# EAGLE design Electronic Synchronized Fireflies (EAGLE 6.4)
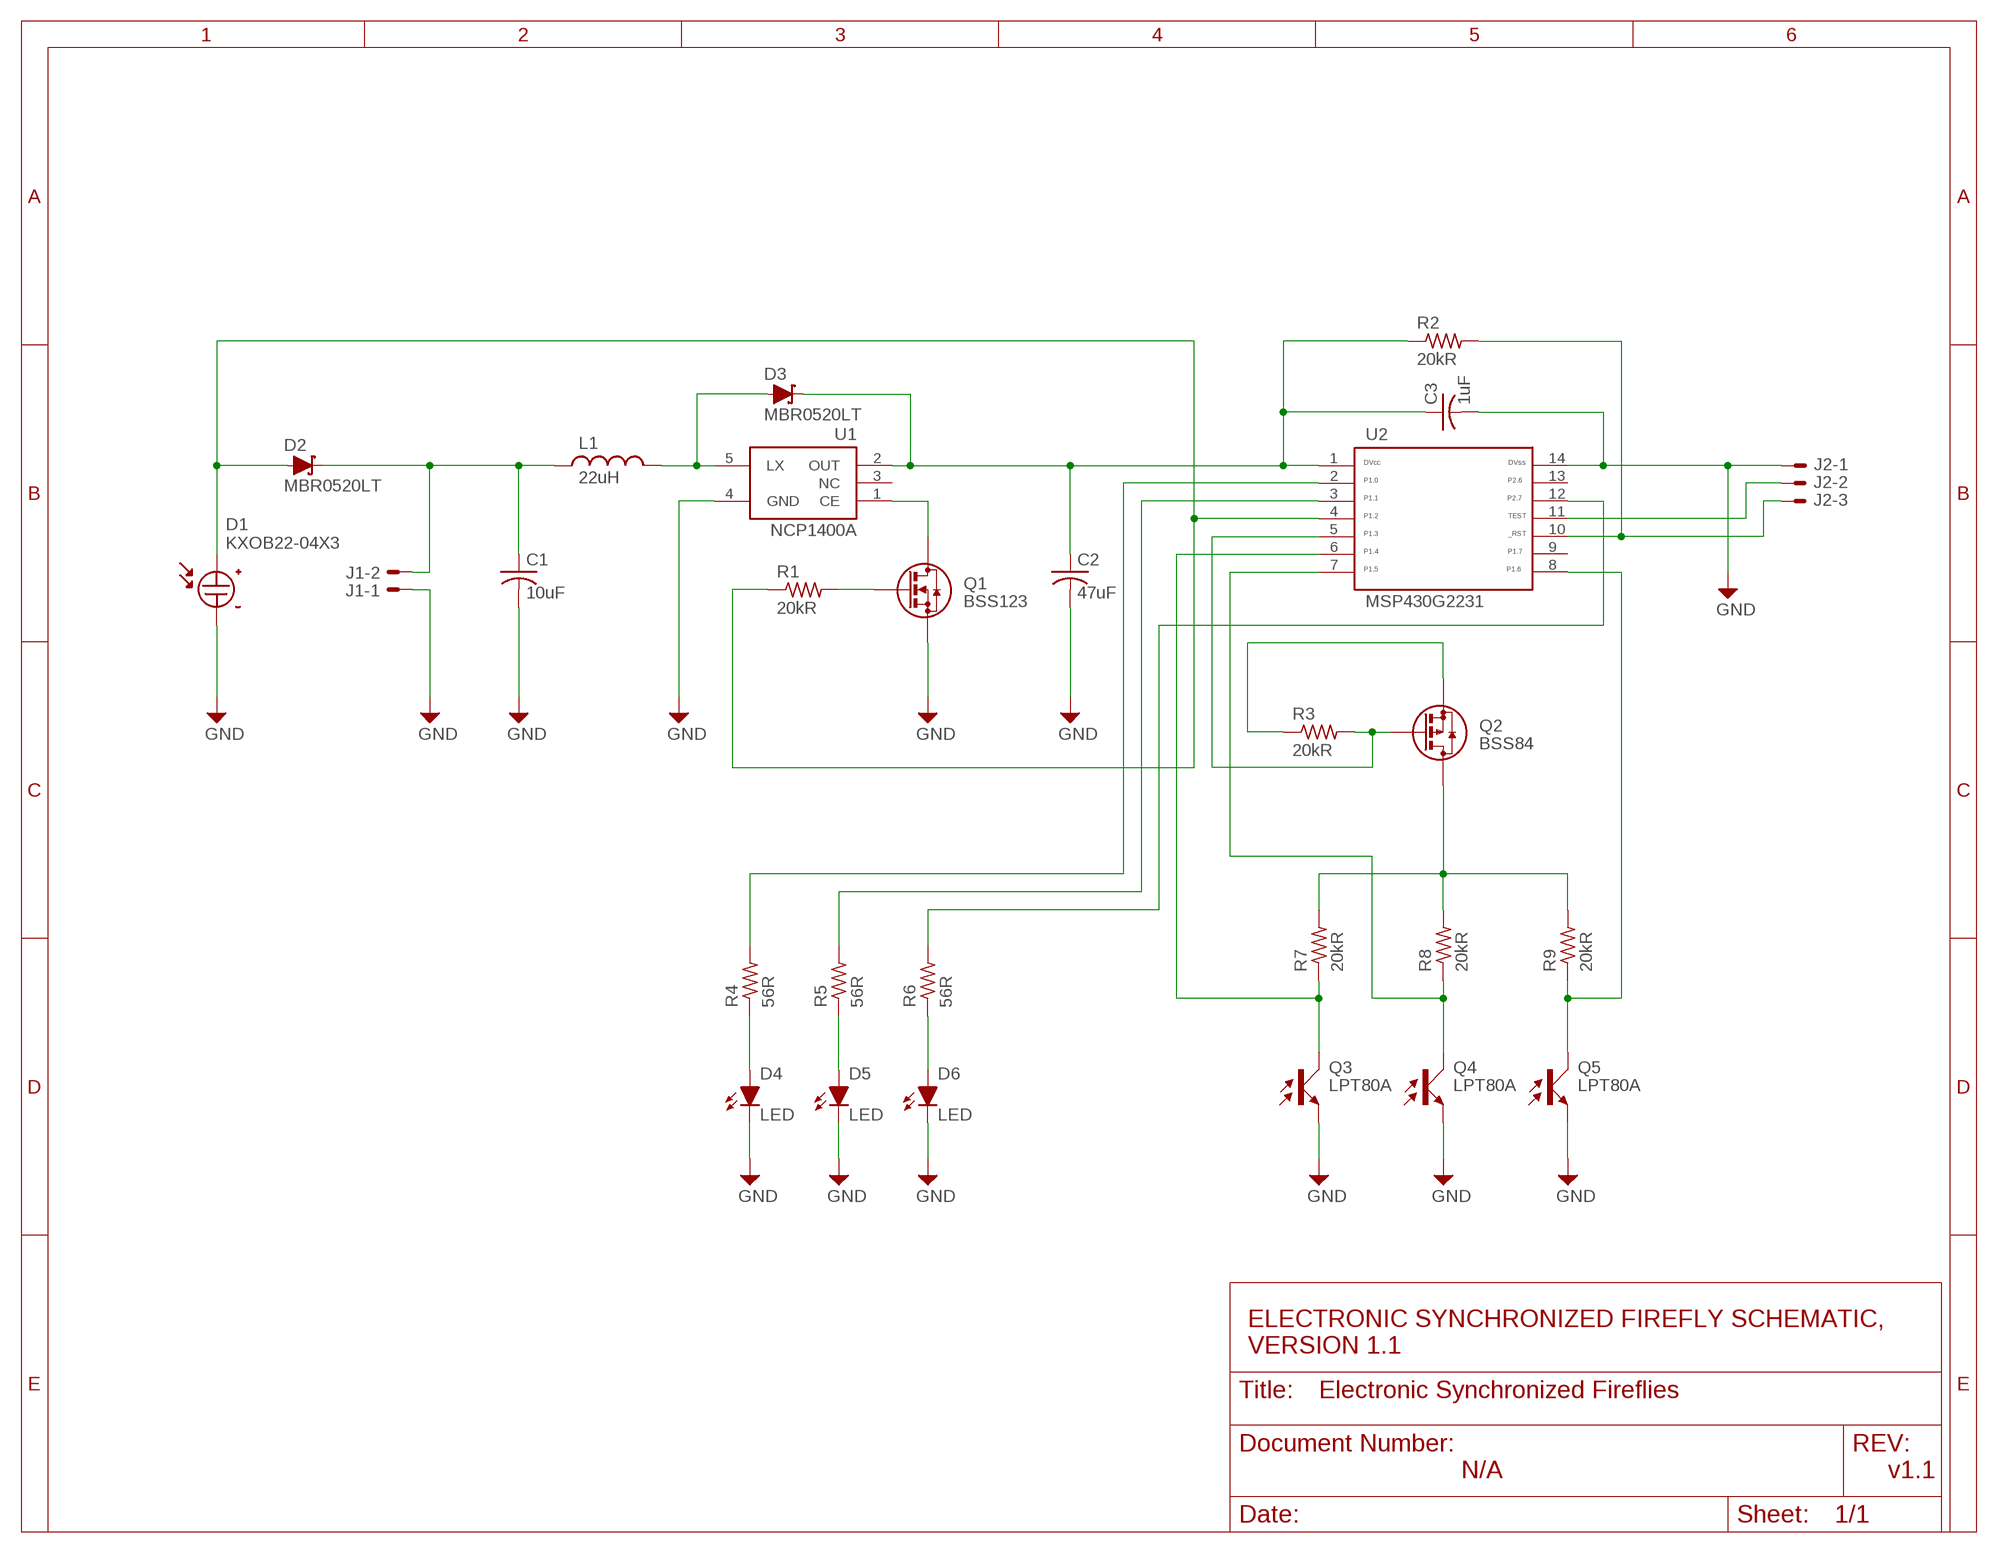
[diagram p0: schematic, sheet 1]

## Parts
C1  10uF  CAPACITOR  [CAPACITOR_0805]
C2  47uF  CAPACITOR  [CAPACITOR_0805]
C3  1uF  CAPACITOR  [CAPACITOR_0805]
D1  KXOB22-04X3  [KXOB22-04X3]
D2  MBR0520LT  [SOD123]
D3  MBR0520LT  [SOD123]
D4  LED  LEDRTANGLEHOLDER  [LED5MMRT]
D5  LED  LEDRTANGLEHOLDER  [LED5MMRT]
D6  LED  LEDRTANGLEHOLDER  [LED5MMRT]
FRAME1  FRAME_A_L  [FRAME_A_L]
J1  2WIRE_HEADER  [2WIRE_HEADER]
J2  3WIRE_HEADER  [3WIRE_HEADER]
L1  22uH  INDUCTOR  [INDUCTOR_1007]
Q1  BSS123  [SOT23]
Q2  BSS84  [SOT23]
Q3  LPT80A  LPT80ARTANGLEHOLDER  [LED5MMRT]
Q4  LPT80A  LPT80ARTANGLEHOLDER  [LED5MMRT]
Q5  LPT80A  LPT80ARTANGLEHOLDER  [LED5MMRT]
R1  20kR  RESISTOR  [RESISTOR_0805]
R2  20kR  RESISTOR  [RESISTOR_0805]
R3  20kR  RESISTOR  [RESISTOR_0805]
R4  56R  RESISTOR  [RESISTOR_0805]
R5  56R  RESISTOR  [RESISTOR_0805]
R6  56R  RESISTOR  [RESISTOR_0805]
R7  20kR  RESISTOR  [RESISTOR_0805]
R8  20kR  RESISTOR  [RESISTOR_0805]
R9  20kR  RESISTOR  [RESISTOR_0805]
U1  NCP1400A  [SOT23-5]
U2  MSP430G2231  [TSSOP-14]
U$1  DOCFIELD  [DOCFIELD]

## Nets
GND: C1.2 C2.2 C3.2 D1.P$2(-) D4.K(C) D5.K(C) D6.K(C) J1.1 J2.1 Q1.3(D) Q3.K(E) Q4.K(E) Q5.K(E) U1.4(GND) U2.14
N$1: C1.1 D2.C J1.2 L1.P$1
N$2: D1.P$1(+) D2.A R1.1 U2.4
N$3: D3.A L1.P$2 U1.5(LX)
N$4: Q2.1(G) R3.2 U2.5
N$5: C2.1 C3.1 D3.C R2.1 U1.2(OUT) U2.1
N$6: Q1.2(S) U1.1(CE)
N$7: Q1.1(G) R1.2
N$9: J2.3 R2.2 U2.10
N$10: Q2.2(S) R3.1
N$11: J2.2 U2.11
N$12: Q2.3(D) R7.2 R8.2 R9.2
N$13: Q4.A(C) R8.1 U2.7
N$14: Q3.A(C) R7.1 U2.6
N$15: Q5.A(C) R9.1 U2.8
N$16: R4.2 U2.2
N$17: R5.2 U2.3
N$18: R6.2 U2.12
N$20: D5.A R5.1
N$21: D6.A R6.1
N$22: D4.A R4.1
Unconnected: U1.3(NC) U2.9 U2.13

## Notes on the sheet
- ELECTRONIC SYNCHRONIZED FIREFLY SCHEMATIC, 
  VERSION 1.1
- N/A | v1.1

## Library data of the parts
C1-C3 = Electronic Synchronized Fireflies:CAPACITOR
D1 = Electronic Synchronized Fireflies:KXOB22-04X3: IXOLAR High Efficiency SolarBIT
D2 D3 = Electronic Synchronized Fireflies:MBR0520LT: SCHOTTKY BARRIER RECTIFIER Source: http://onsemi.com .. MBR0520LT1-D.pdf
D4-D6 = Electronic Synchronized Fireflies:LED
FRAME1 = Electronic Synchronized Fireflies:FRAME_A_L: FRAME A Size , 8 1/2 x 11 INCH, Landscape
J1 = Electronic Synchronized Fireflies:2WIRE_HEADER: .100" (2.54mm) Center Header - 2 Pin; MF: MOLEX; MPN: 22-23-2021; OC_FARNELL: 1462926; OC_NEWARK: 25C3832
J2 = Electronic Synchronized Fireflies:3WIRE_HEADER: .100" (2.54mm) Center Header - 3 Pin; MF: MOLEX; MPN: 22-23-2031; OC_FARNELL: 1462950; OC_NEWARK: 30C0862
L1 = Electronic Synchronized Fireflies:INDUCTOR
Q1 = Electronic Synchronized Fireflies:BSS123: N-CHANNEL MOS FET
Q2 = Electronic Synchronized Fireflies:BSS84: P-CHANNEL MOS FET
Q3-Q5 = Electronic Synchronized Fireflies:LPT80A: PHOTO TRANSISTOR
R1-R9 = Electronic Synchronized Fireflies:RESISTOR
U1 = Electronic Synchronized Fireflies:NCP1400A: NCP1400A - 100mA PWM Step-Up Regulator 100mA step-up DC-to-DC converter with low 0.8V startup. 3.3V Version (SOT23-5) - Digikey: NCP1400ASN33T1GOSCT-ND 5.0V Version (SOT23-5) - Digikey: NCP1400ASN50T1GOSCT-ND NCP1402 - 200mA PWM Step-Up Regulator 200mA step-up DC-to-DC converter with low 0.8V startup 3.3V Version (SOT23-5) - Digikey: NCP1402SN33T1GOSCT-ND 5.0V Version (SOT23-5) - Digikey: NCP1402SN50T1GOSCT-ND
U2 = Electronic Synchronized Fireflies:MSP430G2231: MSP430G2231 TSSOP (PW) 14 Pin Package http://focus.ti.com/docs/prod/folders/print/msp430g2231.html
U$1 = Electronic Synchronized Fireflies:DOCFIELD

## Board
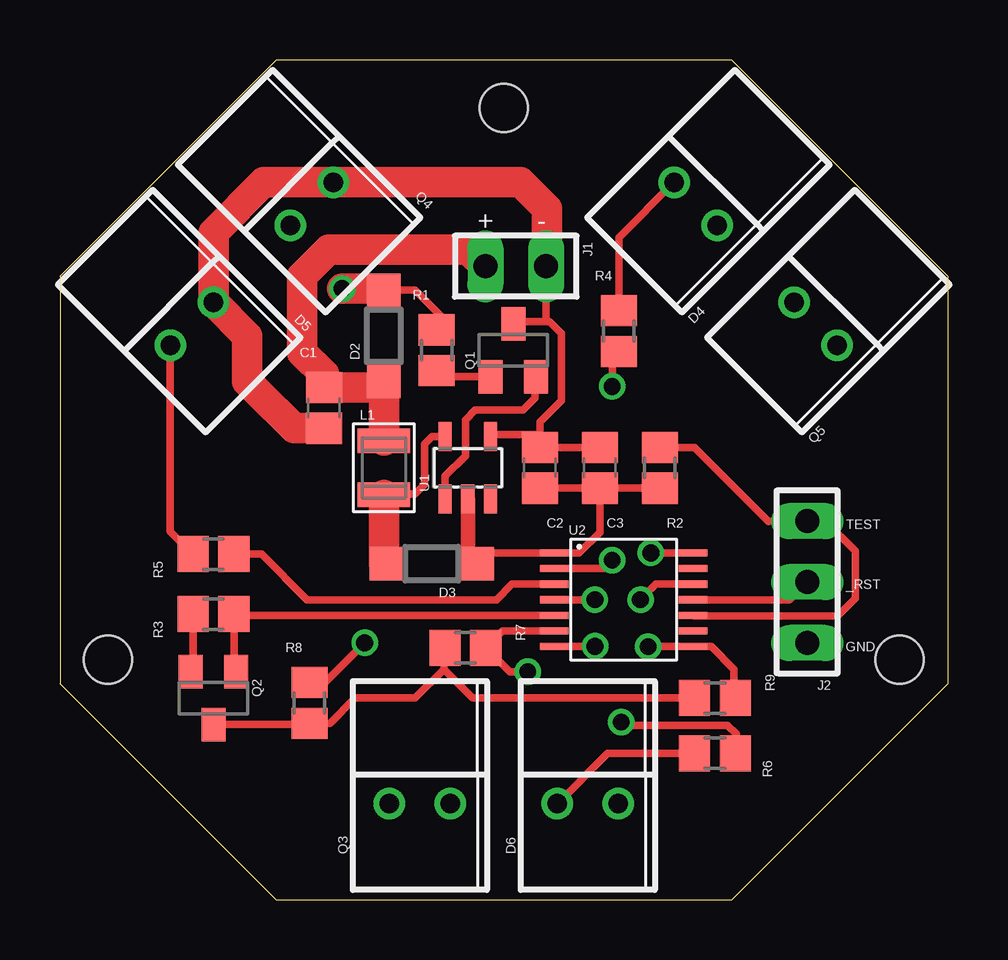
[diagram p1: board, top side]
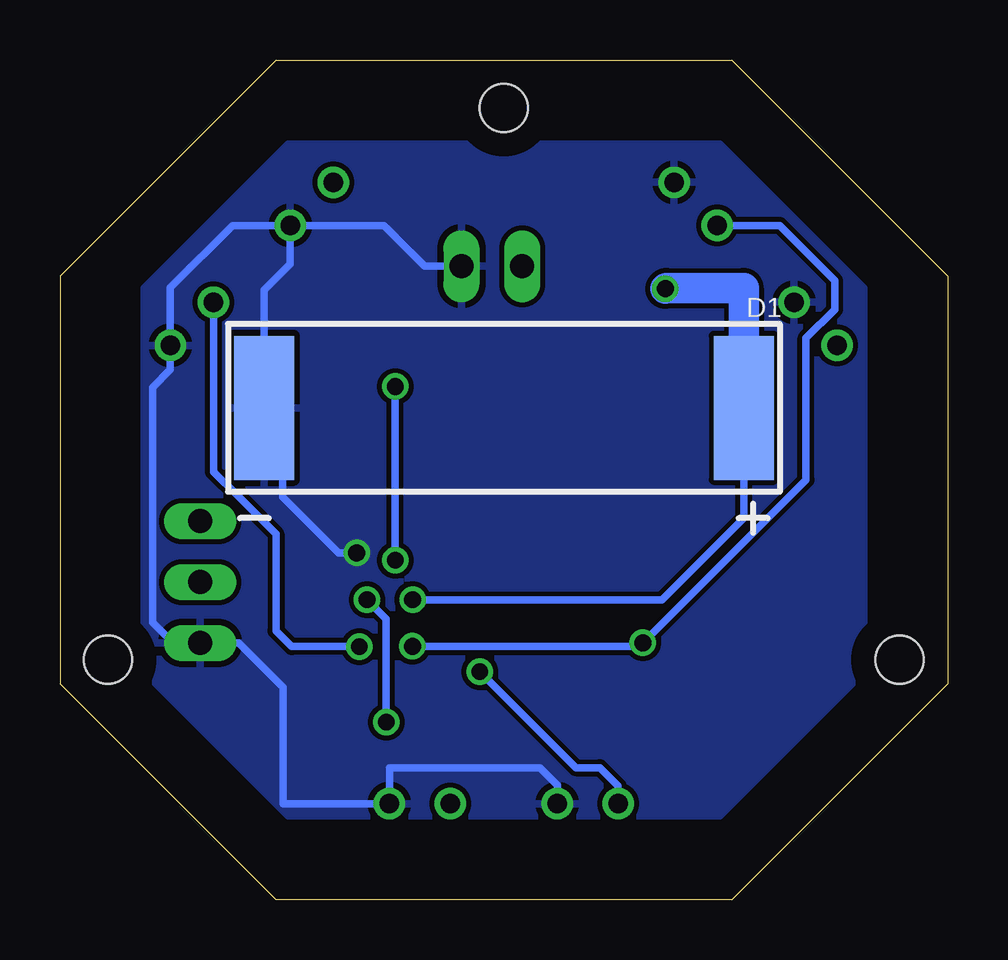
[diagram p2: board, bottom side, seen from below]

Size 37 x 35 mm. Coordinates in mm from the lower left corner, seen from the top.
Outline: 28,35 9,35 0,26 0,9 9,0 28,0 37,9 37,26 28,35
Copper layers (1*16): Top 0.035mm / dielectric 1.5mm / Bottom 0.035mm
Design rules "default": minimum track width 10mil, minimum drill 24mil, track to track 8mil, track to pad 8mil, pad to pad 8mil, via to via 8mil, smd to smd 8mil, copper to edge 40mil, drill to drill 8mil, minimum pad ring 10mil, minimum via ring 8mil, stop-mask expansion 4mil, vias tented up to drill 0mil, thermal gap 10mil
Holes 2 mm at 2,10 35,10 18.5,33

### Footprints (pad centres in the part's own frame; a part is rotated, then mirrored left to right if it is on the bottom)
CAPACITOR_0805 = smd 1.3 x 1.5: 1 -0.85,0; 2 0.85,0
KXOB22-04X3 = smd 2.5 x 6: P$1 -10,0; P$2 10,0
SOD123 = smd 1.4 x 1.4: A 1.9,0; C -1.9,0
LED5MMRT = drill 0.813: A -1.27,0; K 1.27,0
2WIRE_HEADER = drill 1 long: 1 -1.27,0; 2 1.27,0
3WIRE_HEADER = drill 1 long: 1 -2.54,0; 2 0,0; 3 2.54,0
INDUCTOR_1007 = smd 1.016 x 2.2: P$1 -1.127,0; P$2 1.127,0
SOT23 = smd 1 x 1.4: 1 -0.95,-1.1; 2 0.95,-1.1; 3 0,1.1
RESISTOR_0805 = smd 1.3 x 1.5: 1 -0.85,0; 2 0.85,0
SOT23-5 = smd 0.55 x 1.2: 1 -0.95,-1.3; 2 0,-1.3; 3 0.95,-1.3; 4 0.95,1.3; 5 -0.95,1.3
TSSOP-14 = smd 0.3 x 1.2: 1 -1.95,-2.9; 2 -1.3,-2.9; 3 -0.65,-2.9; 4 0,-2.9; 5 0.65,-2.9; 6 1.3,-2.9; 7 1.95,-2.9; 8 1.95,2.9; 9 1.3,2.9; 10 0.65,2.9; 11 0,2.9; 12 -0.65,2.9; 13 -1.3,2.9; 14 -1.95,2.9

### Placement (x,y rotation side)
C1  11,20.5 270 top
C2  20,18 90 top
C3  22.5,18 90 top
D1  18.5,20.5 180 bottom
D2  13.5,23.5 90 top
D3  15.5,14 180 top
D4  26.5,29 315 top
D5  5.5,24 45 top
D6  22,4 0 top
FRAME1  -116.84,-91.44 0 top  (outside the outline)
J1  19,26.4 180 top
J2  31.15,13.24 90 top
L1  13.5,18 270 top
Q1  18.9,22.9 0 top
Q2  6.4,8.4 180 top
Q3  15,4 0 top
Q4  10.5,29 45 top
Q5  31.5,24 315 top
R1  15.7,22.9 270 top
R2  25,18 90 top
R3  6.4,11.9 0 top
R4  23.3,23.7 270 top
R5  6.4,14.4 0 top
R6  27.3,6.1 0 top
R7  16.9,10.5 180 top
R8  10.4,8.2 270 top
R9  27.3,8.4 180 top
U1  17,18 0 top
U2  23.5,12.5 270 top
U$1  55.88,-91.44 0 top  (outside the outline)

### Tracks (layer width: path | path; a pad name or v marks a point on that pad's centre or on a via)
GND  (via drill 0.7)
  Top 0.305: 20,19.38 C2.2 C3.2 22.87,19.22 | 20,19.38 20,19.6 20,19.8 20,19.9 20.9,20.8 20.9,23.6 20.4,24.1 20.2,24.1 | 17.95,19.75 U1.4 17.95,19.38 20,19.38 | 19,24.1 Q1.3 19,24.1 | 20.2,24.1 19,24.1 | 20.2,24.1 20.27,24.16 J1.1 | U2.14 v24.63,14.45
  Top 1.27: C1.2 9.75,19.65 8.2,21.2 7.8,21.6 7.8,23.5 D5.K 6.4,27.8 8.5,29.9 Q4.K 19.2,29.9 20.3,28.8 20.3,26.43 J1.1
  Bottom 0.305: 27.72,18.33 27.72,19.72 D1.P$2 28.5,25.4 27.4,26.5 D4.K | 27.72,18.33 27.72,16.79 25.38,14.45 v24.63,14.45 | 27.91,17.73 27.72,17.92 27.72,18.33 | D4.K 29.8,28.1 32.4,25.5 Q5.K 32.4,22.09 33.14,21.34 33.14,11.55 32.29,10.7 J2.1 29.55,10.7 27.7,8.84 27.7,4 D6.K 23.27,5.5 17,5.5 16.27,4.77 Q3.K | D4.K | D4.K | J1.1 21.8,26.4 23.5,28.1 D4.K
  pour Bottom: 3.5,25.5 3.5,9.5 9.5,3.5 27.5,3.5 33.5,9.5 33.5,25.5 27.5,31.5 9.5,31.5
N$1
  Top 1.27: L1.P$1 D2.C 13.5,21.35 C1.1 11,21.9 10.1,22.8 10.1,26 11.2,27.1 17.03,27.1 J1.2
N$2  (via drill 0.7)
  Top 0.305: R1.1 16,24.2 14.8,25.4 D2.A | U2.4 v22.3,12.5
  Top 1.27: D2.A 13.44,25.46 v11.76,25.46
  Bottom 0.305: v22.3,12.5 11.9,12.5 8.5,15.9 D1.P$1
  Bottom 1.27: D1.P$1 8.5,25.5 11.73,25.5 v11.76,25.46
N$3
  Top 0.305: U1.5 15.5,19.3 15.2,19 15.2,17.3 14.8,16.9 13.53,16.9 L1.P$2
  Top 1.27: L1.P$2 13.5,14 D3.A
N$4
  Top 0.305: U2.5 11.65,11.85 7.3,11.85 R3.2 7.25,9.6 Q2.1
N$5
  Top 0.305: D3.C arc-90 17.85,14.45 U2.1 21.64,14.45 22.5,15.31 C3.1 | C2.1 C3.1 | C3.1 R2.1
  Top 0.61: U1.2 17,14.4 D3.C
N$6
  Top 0.305: U1.1 16.05,17.65 16.9,18.5 16.9,20 17.3,20.4 19.3,20.4 19.8,20.9 19.8,21.75 Q1.2
N$7
  Top 0.305: R1.2 16.25,21.9 16.35,21.8 Q1.1
N$9
  Top 0.305: U2.10 26.42,11.83 32.42,11.83 33.15,12.55 33.15,14.54 31.89,15.78 31.19,15.78 J2.3 29.52,15.77 26.44,18.85 R2.2
N$10
  Top 0.305: R3.1 5.55,9.6 Q2.2
N$11
  Top 0.305: U2.11 30.42,12.5 J2.2
N$12
  Top 0.305: Q2.3 9.4,7.3 10.35,7.3 R8.2 11.25,7.35 12.3,8.4 14.8,8.4 16,9.6 | R9.2 20.1,8.4 17.2,8.4 16.3,9.3 16,9.6 | 16,9.6 16,10.45 R7.2
N$13  (via drill 0.7)
  Top 0.305: U2.7 v22.31,10.55 | R8.1 11.05,9.05 v12.7,10.7
  Bottom 0.305: v22.31,10.55 18.1,10.55 12.85,10.55 v12.7,10.7 | v12.7,10.7 12.45,10.95 | 12.45,10.95 7,16.4 5.9,17.5 5.9,23.4 4.7,24.6 4.7,25.8 7,28.1 8.5,28.1 Q4.A | v12.7,10.7 12.45,10.95
N$14  (via drill 0.7)
  Top 0.305: U2.6 18.45,11.2 R7.1 18.75,9.5 v19.5,9.5
  Bottom 0.305: v19.5,9.5 15.5,5.5 14.5,5.5 13.73,4.73 Q3.A
N$15  (via drill 0.7)
  Top 0.305: U2.8 27.15,10.55 | 27.15,10.55 28.1,9.6 28.1,8.45 R9.1 | 27.15,10.55 v24.53,10.55 v24.52,10.54
  Bottom 0.305: v24.52,10.54 27.34,10.54 28,11.2 28,15.23 29.6,16.83 30.6,17.83 30.6,23.1 Q5.A
N$16  (via drill 0.7)
  Top 0.305: U2.2 22.68,13.8 v23.02,14.14 | v23.02,21.39 23.02,22.57 R4.2
  Bottom 0.305: v23.02,14.14 v23.02,21.39
N$17
  Top 0.305: U2.3 18.85,13.15 18.2,12.5 10.3,12.5 8.4,14.4 R5.2
N$18  (via drill 0.7)
  Top 0.305: U2.12 24.85,13.15 v24.2,12.5 | v23.4,7.4 23.53,7.27 27.83,7.27 28.2,6.9 28.2,6.15 R6.2
  Bottom 0.305: v24.2,12.5 23.4,11.7 23.4,7.5 v23.4,7.4
N$20
  Top 0.305: 5.5,14.45 R5.1 4.6,15.35 D5.A
N$21
  Top 0.305: R6.1 22.83,6.1 D6.A
N$22
  Top 0.305: R4.1 23.3,27.6 D4.A

### Text on the board
tNames: + | - | TEST | _RST | GND | ELECTRONIC SYNCHRONIZED FIREFLY BOARD / LAYOUT, VERSION 2.0 | N/A | v2.0